# EAGLE design CanSatPrimaria (EAGLE 9.5.2)
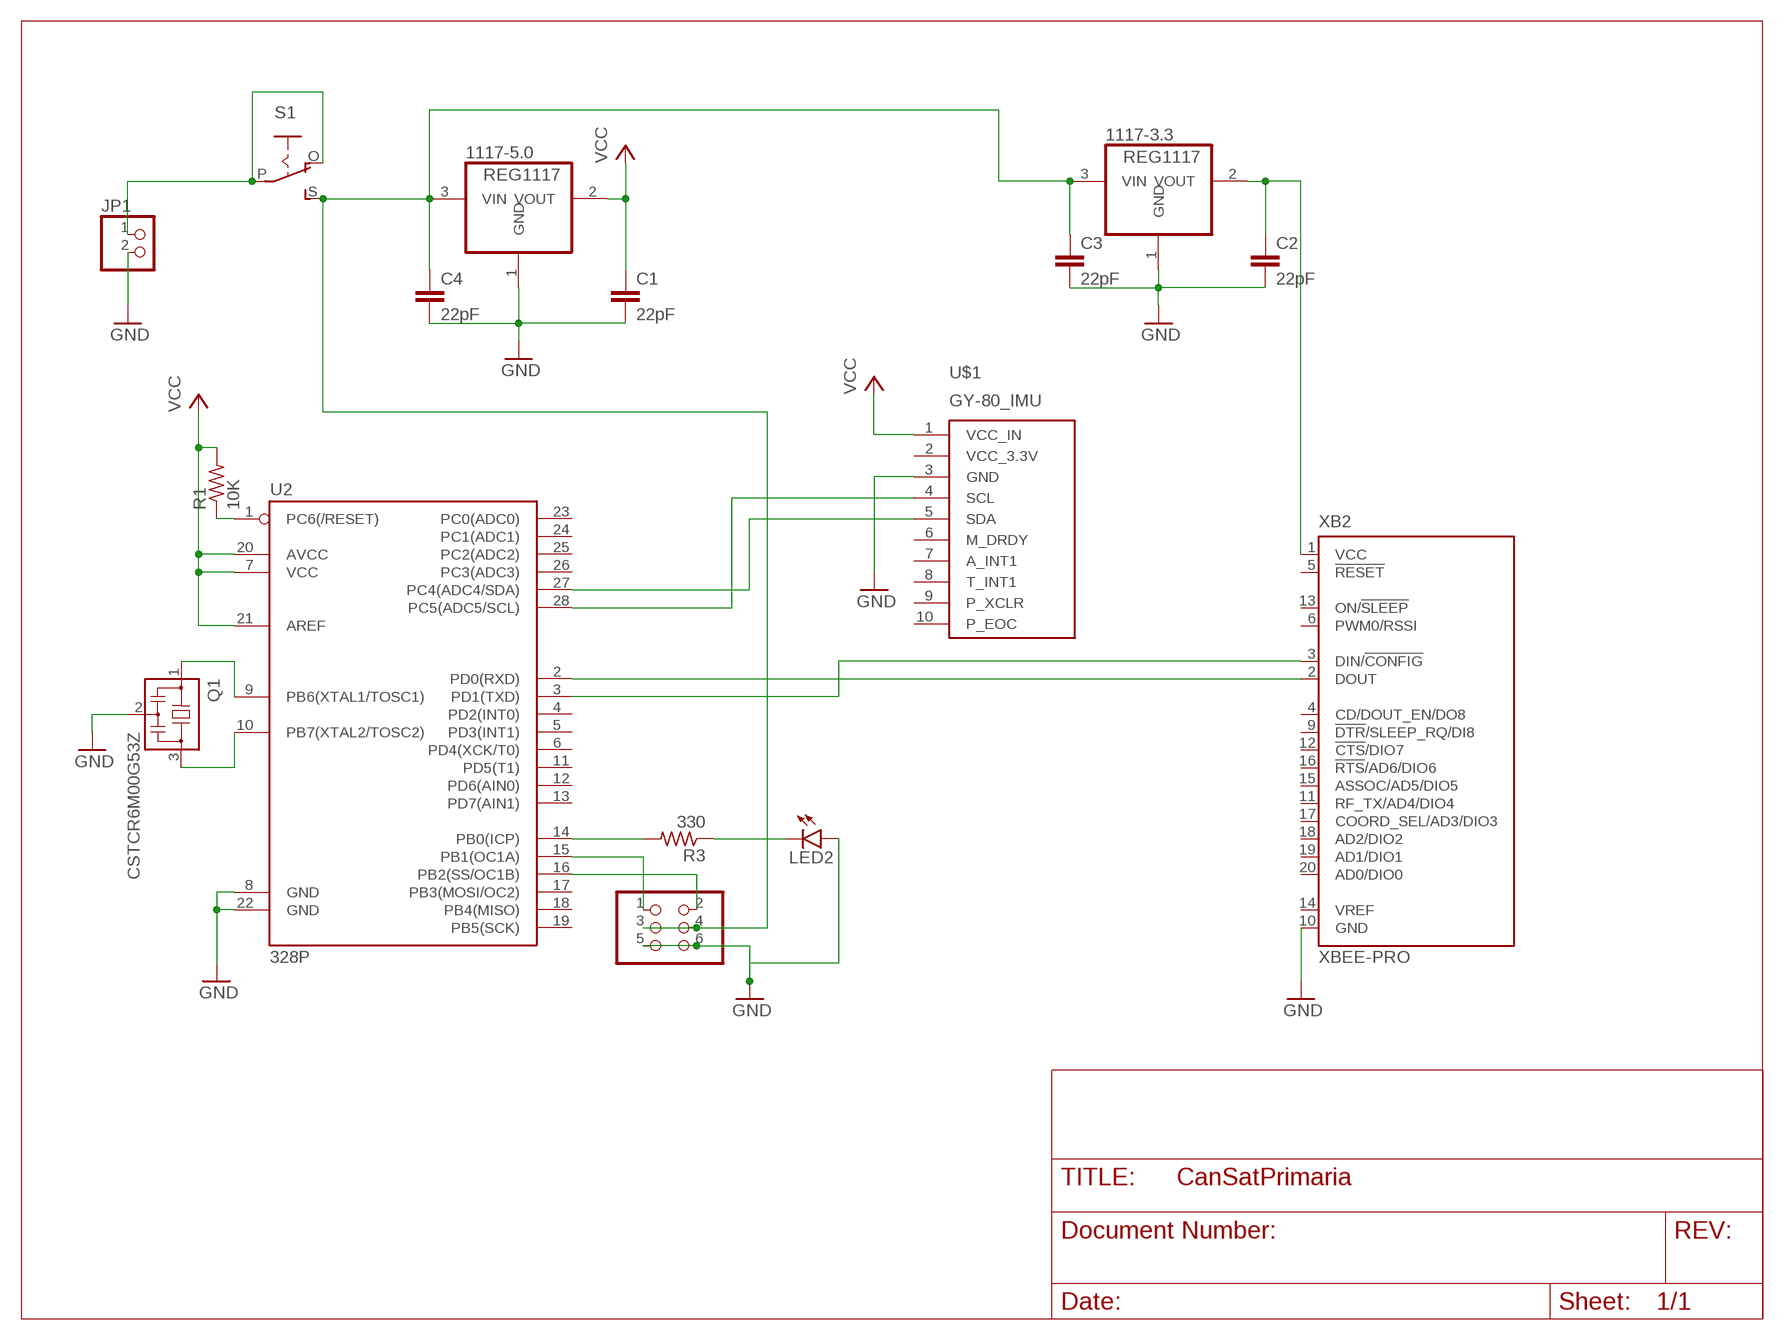
[diagram p0: schematic, sheet 1]

## Parts
1117-3.3  REG1117  [SOT223]
1117-5.0  REG1117  [SOT223]
C1  22pF  C-EUC1206  [C1206]
C2  22pF  C-EUC1206  [C1206]
C3  22pF  C-EUC1206  [C1206]
C4  22pF  C-EUC1206  [C1206]
JP1  PINHD-1X2  [1X02]
JP3  PINHD-2X3  [2X03]
LED2  LEDCHIPLED_1206  [CHIPLED_1206]
Q1  CSTCR6M00G53Z  [CSTCR6M]
R1  10K  R-US_M1206  [M1206]
R3  330  R-US_M1206  [M1206]
S1  EG1218S  [EG1218]
U2  328P  ATMEGA328P_PDIP  [DIP28]
U$1  GY-80_IMU  [MA10-1]
XB2  XBEE-PRO  [XBEE-PRO]

## Nets
GND: 1117-3.3.1(GND) 1117-5.0.1(GND) C1.2 C2.2 C3.2 C4.2 JP1.2 JP3.5 JP3.6 LED2.A Q1.2 U2.8(GND) U2.22(GND) U$1.3(GND) XB2.10(GND)
N$1: 1117-3.3.2(VOUT) C2.1 XB2.1(VCC)
N$2: Q1.1 U2.9(PB6(XTAL1/TOSC1))
N$3: U2.2(PD0(RXD)) XB2.2(DOUT)
N$4: Q1.3 U2.10(PB7(XTAL2/TOSC2))
N$5: R1.1 U2.1(PC6(/RESET))
N$6: U2.27(PC4(ADC4/SDA)) U$1.5(SDA)
N$7: U2.3(PD1(TXD)) XB2.3(DIN/!CONFIG)
N$9: JP1.1 S1.O S1.P
N$10: U2.28(PC5(ADC5/SCL)) U$1.4(SCL)
N$11: JP3.2 U2.16(PB2(SS/OC1B))
N$12: JP3.1 U2.15(PB1(OC1A))
N$13: R3.2 U2.14(PB0(ICP))
N$14: LED2.C R3.1
N$15: 1117-3.3.3(VIN) 1117-5.0.3(VIN) C3.1 C4.1 JP3.3 JP3.4 S1.S
VCC: 1117-5.0.2(VOUT) C1.1 R1.2 U2.7(VCC) U2.20(AVCC) U2.21(AREF) U$1.1(VCC_IN)
Unconnected: U2.4(PD2(INT0)) U2.5(PD3(INT1)) U2.6(PD4(XCK/T0)) U2.11(PD5(T1)) U2.12(PD6(AIN0)) U2.13(PD7(AIN1)) U2.17(PB3(MOSI/OC2)) U2.18(PB4(MISO)) U2.19(PB5(SCK)) U2.23(PC0(ADC0)) U2.24(PC1(ADC1)) U2.25(PC2(ADC2)) U2.26(PC3(ADC3)) U$1.2(VCC_3.3V) U$1.6(M_DRDY) U$1.7(A_INT1) U$1.8(T_INT1) U$1.9(P_XCLR) U$1.10(P_EOC) XB2.4(CD/DOUT_EN/DO8) XB2.5(!RESET) XB2.6(PWM0/RSSI) XB2.9(!DTR!/SLEEP_RQ/DI8) XB2.11(RF_TX/AD4/DIO4) XB2.12(!CTS!/DIO7) XB2.13(ON/!SLEEP) XB2.14(VREF) XB2.15(ASSOC/AD5/DIO5) XB2.16(!RTS!/AD6/DIO6) XB2.17(COORD_SEL/AD3/DIO3) XB2.18(AD2/DIO2) XB2.19(AD1/DIO1) XB2.20(AD0/DIO0)

## Library data of the parts
1117-3.3 1117-5.0 = burr-brown:REG1117: 800mA and 1A Low Dropout (LDO) Positive Regulator 1.8V, 2.5V, 2.85V, 3.3V, 5V, and Adj; MPN: REG1117; OC_FARNELL: 1097566; OC_NEWARK: 14P6981
C1-C4 = rcl:C-EU: CAPACITOR, European symbol; SPICEPREFIX: C
JP1 = pinhead:PINHD-1X2: PIN HEADER
JP3 = pinhead:PINHD-2X3: PIN HEADER
LED2 = led:LED: LED OSRAM: - CHIPLED LG R971, LG N971, LY N971, LG Q971, LY Q971, LO R971, LY R971 LH N974, LH R974 LS Q976, LO Q976, LY Q976 LO Q996 - Hyper CHIPLED LW Q18S LB Q993, LB Q99A, LB R99A - SideLED LS A670, LO A670, LY A670, LG A670, LP A670 LB A673, LV A673, LT A673, LW A673 LH A674 LY A675 LS A676, LA A676, LO A676, LY A676, LW A676 LS A679, LY A679, LG A679 - Hyper Micro SIDELED® LS Y876, LA Y876, LO Y876, LY Y876 LT Y87S - SmartLED LW L88C, LW L88S LB L89C, LB L89S, LG L890 LS L89K, LO L89K, LY L89K LS L896, LA L896, LO L896, LY L896 - TOPLED LS T670, LO T670, LY T670, LG T670, LP T670 LSG T670, LSP T670, LSY T670, LOP T670, LYG T670 LG T671, LOG T671, LSG T671 LB T673, LV T673, LT T673, LW T673 LH T674 LS T676, LA T676, LO T676, LY T676, LB T676, LH T676, LSB T676, LW T676 LB T67C, LV T67C, LT T67C, LS T67K, LO T67K, LY T67K, LW E67C LS E67B, LA E67B, LO E67B, LY E67B, LB E67C, LV E67C, LT E67C LW T67C LS T679, LY T679, LG T679 LS T770, LO T770, LY T770, LG T770, LP T770 LB T773, LV T773, LT T773, LW T773 LH T774 LS E675, LA E675, LY E675, LS T675 LS T776, LA T776, LO T776, LY T776, LB T776 LHGB T686 LT T68C, LB T68C - Hyper Mini TOPLED® LB M676 - Mini TOPLED Santana® LG M470 LS M47K, LO M47K, LY M47K Source: http://www.osram.convergy.de LUXEON: - LUMILED® LXK2-PW12-R00, LXK2-PW12-S00, LXK2-PW14-U00, LXK2-PW14-V00 LXK2-PM12-R00, LXK2-PM12-S00, LXK2-PM14-U00 LXK2-PE12-Q00, LXK2-PE12-R00, LXK2-PE12-S00, LXK2-PE14-T00, LXK2-PE14-U00 LXK2-PB12-K00, LXK2-PB12-L00, LXK2-PB12-M00, LXK2-PB14-N00, LXK2-PB14-P00, LXK2-PB14-Q00 LXK2-PR12-L00, LXK2-PR12-M00, LXK2-PR14-Q00, LXK2-PR14-R00 LXK2-PD12-Q00, LXK2-PD12-R00, LXK2-PD12-S00 LXK2-PH12-R00, LXK2-PH12-S00 LXK2-PL12-P00, LXK2-PL12-Q00, LXK2-PL12-R00 Source: www.luxeon.com KINGBRIGHT: KA-3528ASYC Source: www.kingbright.com
Q1 = murata-filter:CSTCR: Resonator Source: murata.co.jp; MPN: CSTCR6M00G53-R0; OC_FARNELL: 1170434; OC_NEWARK: 25M8759
R1 R3 = adafruit:R-US_: RESISTOR, American symbol
S1 = adafruit:EG1218: SLIDING SWITCH 0.1" spacing through hole, vertical SPDT slide switch http://www.ladyada.net/library/pcb/eaglelibrary.html
U2 = SparkFun-IC-Microcontroller:ATMEGA328P_PDIP: Atmel 328P Through hole ATMEGA328P uC used in the Arduino 32kb flash, 1k EEPROM, 2k SRAM Datasheet <http://www.sparkfun.com/datasheets/Components/SMD/ATMega328.pdf> SparkFun Products Storefront component: AVR 28 Pin 20MHz 32K 6A/D - ATMega328P <https://www.sparkfun.com/products/9061> (COM-09061) SparkFun Simon Says - Through-Hole Soldering Kit <https://www.sparkfun.com/products/10547> (KIT-10547) SparkFun Learn to Solder - Simon Says <https://www.sparkfun.com/products/13708> (KIT-13708) SparkFun BigTime Watch Kit <https://www.sparkfun.com/products/11734> (KIT-11734) SparkFun ClockIt <https://www.sparkfun.com/products/10930> (KIT-10930) SparkFun Serial Enabled LCD Kit <https://www.sparkfun.com/products/10097> (LCD-10097) SparkFun Simon Tilts - Through Hole Soldering Kit <https://www.sparkfun.com/products/12634> (KIT-12634) SparkFun Frequency Counter Kit <https://www.sparkfun.com/products/10140> (KIT-10140) FabFM Radio Kit <https://www.sparkfun.com/products/11043> (KIT-11043) SparkFun Binary Blaster Kit <https://www.sparkfun.com/products/12037> (KIT-12037) SparkFun Metro-Gnome <https://www.sparkfun.com/products/9236> (KIT-09236) ATmega328 with Arduino Optiboot (Uno) <https://www.sparkfun.com/products/10524> (DEV-10524); PROD_ID: IC-09136
U$1 = GY-80:GY-80_IMU: V2.0
XB2 = maxstream:XBEE: XBee (TM) /XBee-PRO(TM) OEM RF Modules Source: MaxStream, Inc. xbee_productmanual.pdf; MPN: XBP24-AWI-001; OC_FARNELL: 1337916; OC_NEWARK: 42M2667

## Board
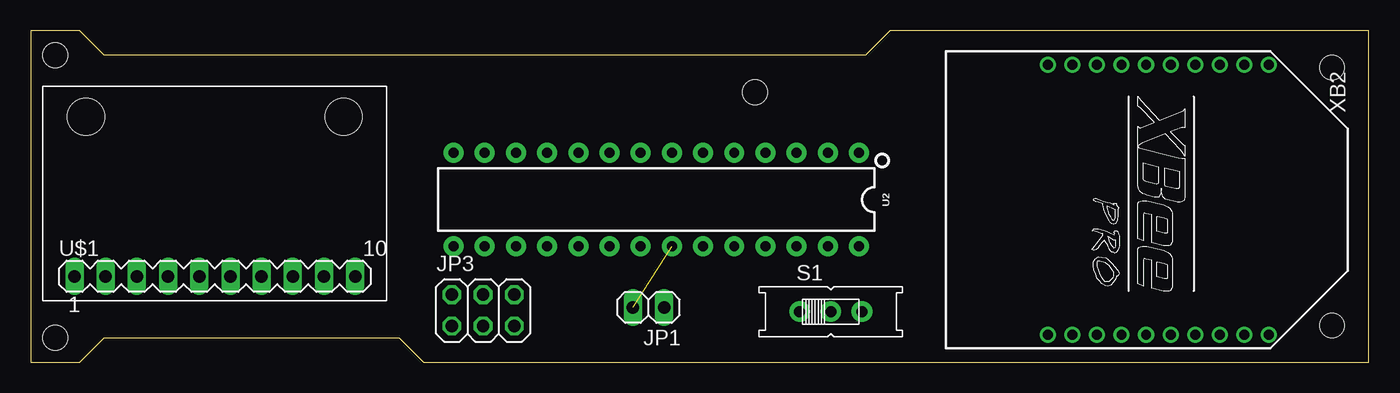
[diagram p1: board, top side]
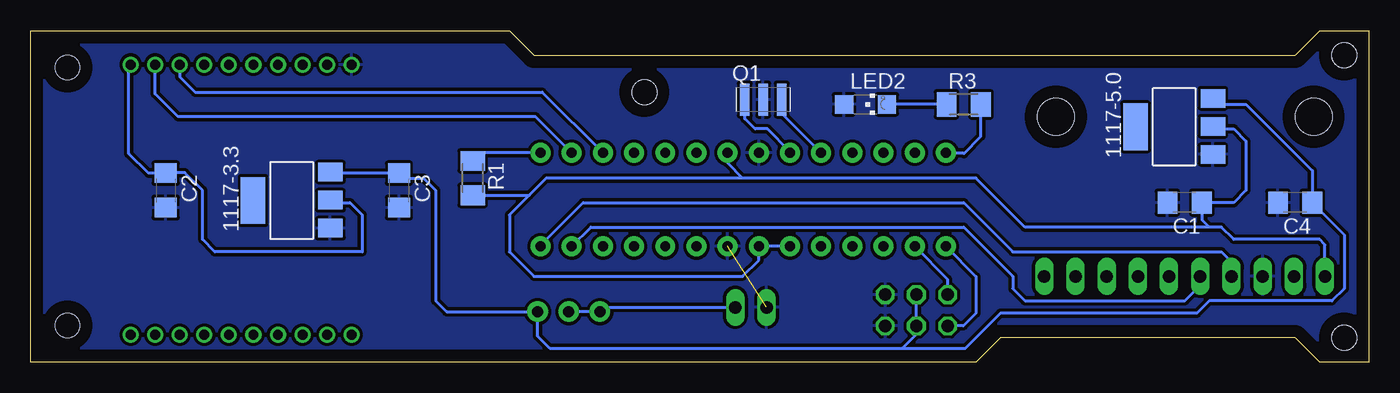
[diagram p2: board, bottom side, seen from below]

Size 109 x 27 mm. Coordinates in mm from the lower left corner, seen from the top.
Outline: 0,0 4,0 6,2 30,2 32,0 109,0 109,27 70,27 68,25 6,25 4,27 0,27 0,0
Copper layers (1*16): Top 0.035mm / dielectric 1.5mm / Bottom 0.035mm
Design rules "default": minimum track width 6mil, minimum drill 0.35mm, track to track 6mil, track to pad 6mil, pad to pad 6mil, via to via 6mil, smd to smd 6mil, copper to edge 40mil, drill to drill 6mil, minimum pad ring 10mil, minimum via ring 8mil, stop-mask expansion 4mil, vias tented up to drill 0mil, thermal gap 10mil
Holes 2 mm at 2,2 2,25 106,3 106,24 59,22
Holes 3 mm at 4.5,20 25.5,20

### Footprints (pad centres in the part's own frame; a part is rotated, then mirrored left to right if it is on the bottom)
SOT223 = smd 1.499 x 2.007: 1 -2.261,-3.15; 2 0.025,-3.15; 3 2.311,-3.15 | smd 3.81 x 2.007: 4 0,3.15
C1206 = smd 1.6 x 1.8: 1 -1.4,0; 2 1.4,0
1X02 = drill 1.016 long: 1 -1.27,0; 2 1.27,0
2X03 = drill 1.016 octagon: 1 -2.54,-1.27; 2 -2.54,1.27; 3 0,-1.27; 4 0,1.27; 5 2.54,-1.27; 6 2.54,1.27
CHIPLED_1206 = smd 1.5 x 1.5: A 0,-1.75; C 0,1.75
CSTCR6M = smd 0.8 x 2.6: 1 -1.5,0; 2 0,0; 3 1.5,0
M1206 = smd 1.6 x 2: 1 -1.4,0; 2 1.4,0
EG1218 = drill 0.9 pad 1.676: O -2.54,0; P 0,0; S 2.54,0
DIP28 = drill 0.813 pad 1.626: 1 -16.51,-3.81; 2 -13.97,-3.81; 3 -11.43,-3.81; 4 -8.89,-3.81; 5 -6.35,-3.81; 6 -3.81,-3.81; 7 -1.27,-3.81; 8 1.27,-3.81; 9 3.81,-3.81; 10 6.35,-3.81; 11 8.89,-3.81; 12 11.43,-3.81; 13 13.97,-3.81; 14 16.51,-3.81; 15 16.51,3.81; 16 13.97,3.81; 17 11.43,3.81; 18 8.89,3.81; 19 6.35,3.81; 20 3.81,3.81; 21 1.27,3.81; 22 -1.27,3.81; 23 -3.81,3.81; 24 -6.35,3.81; 25 -8.89,3.81; 26 -11.43,3.81; 27 -13.97,3.81; 28 -16.51,3.81
MA10-1 = drill 1.016 long: 1 -11.43,0; 2 -8.89,0; 3 -6.35,0; 4 -3.81,0; 5 -1.27,0; 6 1.27,0; 7 3.81,0; 8 6.35,0; 9 8.89,0; 10 11.43,0
XBEE-PRO = drill 0.8 pad 1.27: 1 -11,9; 2 -11,7; 3 -11,5; 4 -11,3; 5 -11,1; 6 -11,-1; 7 -11,-3; 8 -11,-5; 9 -11,-7; 10 -11,-9; 11 11,-9; 12 11,-7; 13 11,-5; 14 11,-3; 15 11,-1; 16 11,1; 17 11,3; 18 11,5; 19 11,7; 20 11,9

### Placement (x,y rotation side)
1117-3.3  87.74,13.18 90 bottom
1117-5.0  15.85,19.18 90 bottom
C1  15,13 180 bottom
C2  98,14 270 bottom
C3  79,14 270 bottom
C4  6,13 180 bottom
JP1  50.33,4.47 180 top
JP3  36.85,4.23 0 top
LED2  41,21 270 bottom
Q1  49.33,21.39 0 bottom
R1  73,15 270 bottom
R3  33,21 0 bottom
S1  65.17,4.12 0 top
U2  50.96,13.24 180 top
U$1  15,7 0 top
XB2  91.86,13.24 270 top

### Tracks (layer width: path | path; a pad name or v marks a point on that pad's centre or on a via)
GND  (1 unrouted)
  pour Bottom (isolate 0.254): 0,27 4,27 6,25 68,25 70,27 109,27 109,0 32,0 30,2 6,2 4,0 0,0
N$1
  Bottom 0.254: 1117-3.3.2 84.39,13 83,13 82,12 82,9 94,9 95,10 95,14 96.44,15.44 97.96,15.44 C2.1 99.4,15.4 101,17 101,24.1 XB2.1
N$2
  Bottom 0.254: U2.9 47.15,17.15 49,19 50,19 50.83,19.83 Q1.1
N$3
  Bottom 0.254: U2.2 67.88,20 97,20 98.86,21.86 XB2.2
N$4
  Bottom 0.254: U2.10 47.83,20.27 Q1.3
N$5
  Bottom 0.254: U2.1 72.35,17.05 R1.1
N$6
  Bottom 0.254: U2.27 63.36,11 33,11 29,7 29,6 28,5 15,5 13.73,6.27 U$1.5
N$7
  Bottom 0.254: XB2.3 96.86,23.24 95.62,22 67.34,22 U2.3
N$9
  Bottom 0.254: JP1.1 62.28,4.47 S1.O S1.P
N$10
  Bottom 0.254: U2.28 67.47,9.53 64,13 33,13 29,9 12,9 11.19,8.19 U$1.4
N$11
  Bottom 0.254: U2.16 34.31,6.75 JP3.2
N$12
  Bottom 0.254: U2.15 32,6.98 32,4 33.04,2.96 JP3.1
N$13
  Bottom 0.254: U2.14 33.05,17.05 33,17 31.6,18.4 R3.2
N$14
  Bottom 0.254: R3.1 LED2.C
N$15
  Bottom 0.254: 38,1.14 66.73,1.14 67.71,2.12 S1.S 75.12,4.12 76,5 76,14 77,15 78.6,15 C3.1 84.5,15.4 1117-3.3.3 | 38,1.14 36.85,2.29 JP3.3 JP3.4 | 38,1.14 32.86,1.14 30,4 14,4 13,5 3,5 2,6 2,10.4 C4.1 4.6,15.6 10,21 12.21,21 1117-5.0.3
VCC
  Bottom 0.254: 51,15 32,15 28,11 13,11 | 51,15 67,15 68.4,13.6 | 68.4,13.6 70,12 70,9 68,7 51,7 49.69,8.31 U2.21 U2.20 | U2.7 52.23,16.23 51,15 | R1.2 68.4,13.6 | 1117-5.0.2 12.5,19 11,19 10,18 10,14 11,13 C1.1 13.6,11.6 13,11 | U$1.1 3.57,9.57 4,10 11,10 12,11 13,11